# Altium schematic sheet clock.SchDoc
size A4
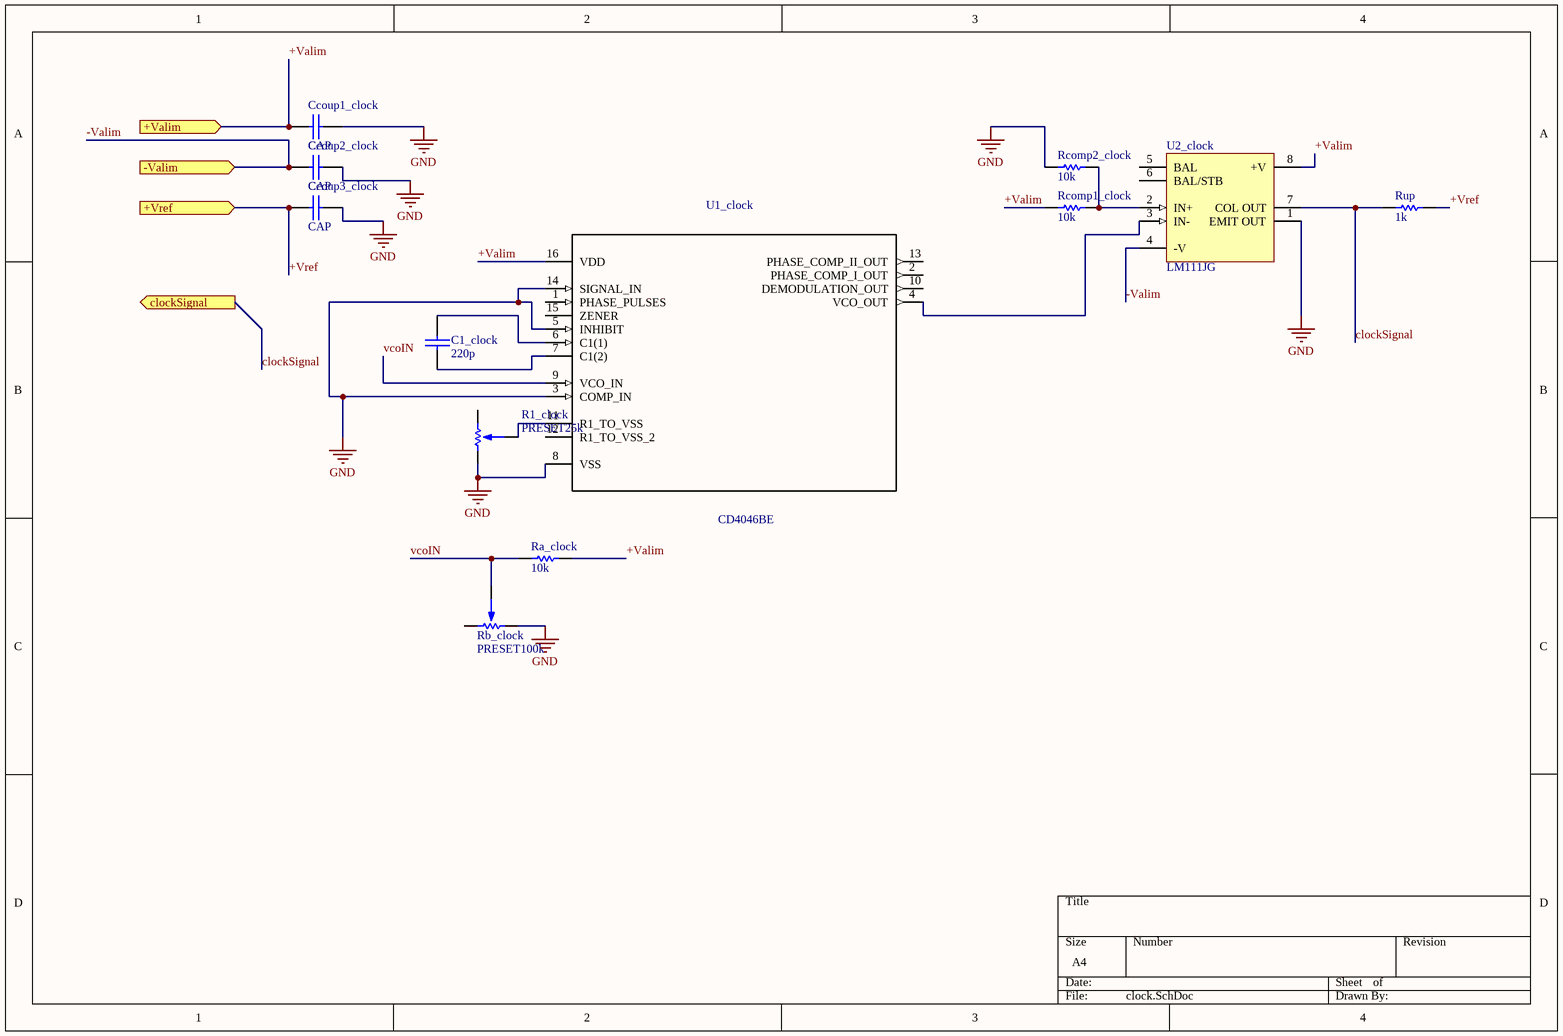
[diagram p0: clock.SchDoc]

## Parts
C1_clock  220p  [CAP200]
Ccoup1_clock  CAP  [CAP200]
Ccoup2_clock  CAP  [CAP200]
Ccoup3_clock  CAP  [CAP200]
R1_clock  PRESET25k  [PRESET V]
Ra_clock  10k  [RES300]
Rb_clock  PRESET100k  [PRESET V]
Rcomp1_clock  10k  [RES300]
Rcomp2_clock  10k  [RES300]
Rup  1k  [RES300]
U1_clock  CD4046BE  [DIP254P762X508-16]
U2_clock  LM111JG  [JG008]

## Ports
+Valim (in), +Vref (in), -Valim (in), clockSignal (out)

## Nets
GND: Ccoup1_clock.2 Ccoup2_clock.2 Ccoup3_clock.2 R1_clock.3 Rb_clock.3 Rcomp2_clock.1 U1_clock.3(COMP_IN) U1_clock.5(INHIBIT) U1_clock.8(VSS) U1_clock.14(SIGNAL_IN) U2_clock.1(EMIT_OUT)
+Valim: Ccoup1_clock.1 Ra_clock.2 Rcomp1_clock.1 U1_clock.16(VDD) U2_clock.8(+V) ; port +Valim
+Vref: Ccoup3_clock.1 Rup.2 ; port +Vref
-Valim: Ccoup2_clock.1 U2_clock.4(-V) ; port -Valim
clockSignal: Rup.1 U2_clock.7(COL_OUT) ; port clockSignal
vcoIN: Ra_clock.1 Rb_clock.2 U1_clock.9(VCO_IN)
NetC1_clock_1: C1_clock.1 U1_clock.6(C1(1))
NetC1_clock_2: C1_clock.2 U1_clock.7(C1(2))
NetR1_clock_2: R1_clock.2 U1_clock.11(R1_TO_VSS)
NetRcomp1_clock_2: Rcomp1_clock.2 Rcomp2_clock.2 U2_clock.2(IN+)
NetU1_clock_4: U1_clock.4(VCO_OUT) U2_clock.3(IN-)

Not connected (* = marked no-connect by the designer): R1_clock 1; Rb_clock 1; U1_clock 1(PHASE_PULSES) 2(PHASE_COMP_I_OUT) 10(DEMODULATION_OUT) 12(R1_TO_VSS_2) 13(PHASE_COMP_II_OUT) 15(ZENER); U2_clock 5(BAL) 6(BAL/STB)

## Library data of the parts
C1_clock = CAP
R1_clock Rb_clock = PRESET
Ra_clock Rcomp1_clock Rcomp2_clock Rup = RES
U1_clock = CD4046BE: Logic - Phase-Locked-Loops and Oscillators Micropower PLL; MF: Texas Instruments; SnapEDA_Link: https://www.snapeda.com/parts/CD4046BE/Texas%20Instruments/view-part/?ref=snap; Availability: Unavailable; Package: PDIP-16 Texas Instruments; Price: None; MP: CD4046BE; Value: *
U2_clock = LM111JG: Differential Comparator with Strobe; Published: 16-Jan-2001; LatestRevisionDate: 04-Mar-2005; LatestRevisionNote: Stylized 3D Model Added.; DatasheetVersion: Feb-1992; PackageVersion: Jan-1995; PackageReference: JG008; Publisher: Altium Limited; PackageDescription: DIP; 8 Leads; Row Spacing 7.62 mm; Pitch 2.54 mm; ComponentLink1Description: Manufacturer Link; ComponentLink1URL: http://www.ti.com/; ComponentLink2Description: Datasheet; ComponentLink2URL: http://www-s.ti.com/sc/ds/lm111.pdf